# Altium schematic sheet power_management.SchDoc
size A
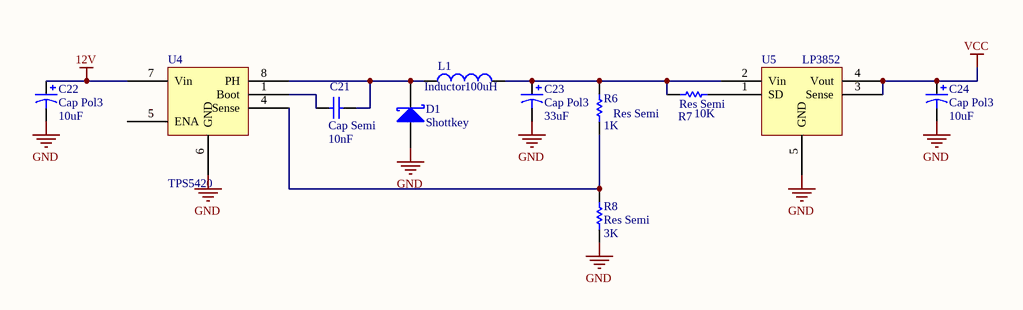
[diagram p0: power_management.SchDoc]

## Parts
C21  Cap Semi  value 10nF  [C0805]
C22  Cap Pol3  value 10uF  [TC6032-2412]
C23  Cap Pol3  value 33uF  [TC6032-2412]
C24  Cap Pol3  value 10uF  [TC3216-1206]
D1  Shottkey  [TO-220AC]
L1  Inductor  value 100uH  [SB_IND]
R6  Res Semi  value 1K  [6-0805_M]
R7  Res Semi  value 10K  [6-0805_M]
R8  Res Semi  value 3K  [6-0805_M]
U4  TPS5420  [SO8_M]
U5  LP3852  [SOT223-5N]

## Nets
12V: C22.1 U4.7(Vin)
GND: C22.2 C23.2 C24.2 D1.3(A) R8.1 U4.6(GND) U5.5(GND)
VCC: C24.1 U5.3(Sense) U5.4(Vout)
NetC21_1: C21.1 U4.1(Boot)
NetC21_2: C21.2 D1.1(K) L1.1 U4.8(PH)
NetC23_1: C23.1 L1.2 R6.2 R7.1 U5.2(Vin)
NetR6_1: R6.1 R8.2 U4.4(Sense)
NetR7_2: R7.2 U5.1(SD)

Not connected (* = marked no-connect by the designer): U4 5(ENA)

## Library data of the parts
C21 = Cap Semi: Capacitor (Semiconductor SIM Model); Published: 8-Jun-2000; LatestRevisionDate: 29-May-2009; LatestRevisionNote: IPC-7351 Footprint Added.; PackageReference: C1206; Publisher: Altium Limited; PackageDescription: Chip Capacitor
C22-C24 = Cap Pol3: Polarized Capacitor (Surface Mount); Published: 8-Jun-2000; LatestRevisionDate: 29-May-2009; LatestRevisionNote: IPC-7351 Footprint Added.; PackageReference: C0805; Publisher: Altium Limited; PackageDescription: Chip Capacitor
  C22: Digikey PN: 718-1052-6-ND
  C23: Digikey PN: 718-1077-1-ND
D1 = Diode 10TQ035: Schottky Rectifier; Note: Terminal 2 is the TAB and is electrically connected to the cathode; Published: 8-Jun-2000; LatestRevisionDate: 17-Jul-2002; LatestRevisionNote: Re-released for DXP Platform.; DatasheetVersion: PD-2.057B; PackageVersion: Feb-1998; PackageReference: TO-220AC; Publisher: Altium Limited; PackageDescription: TO, Thru-Hole, Vertical, Heatsink Mounted; 3 In-Line Leads (1 Absent); Pitch 2.54 mm; ComponentLink1Description: Manufacturer Link; ComponentLink1URL: http://www.irf.com/; ComponentLink2Description: Datasheet; ComponentLink2URL: http://www.irf.com/product-info/datasheets/data/10tq.pdf; Digikey PN: B340A-FDICT-ND
L1 = Inductor: Code_IEC: 1005; Published: 8-Jun-2000; LatestRevisionDate: 29-May-2009; LatestRevisionNote: IPC-7351 Footprint Added.; PackageReference: 0402-A; Publisher: Altium Limited; PackageDescription: Chip Inductor; Code_JEITA: 0402; Digikey PN: 495-1987-1-ND
R6-R8 = Res Semi: Semiconductor Resistor; Published: 8-Jun-2000; LatestRevisionDate: 17-Jul-2002; LatestRevisionNote: Re-released for DXP Platform.; PackageReference: AXIAL-0.5; Publisher: Altium Limited
  R6 R8: PackageDescription: Axial Device, Thru-Hole; 2 Leads; 0.5 in Pin Spacing
U4 = TPS5420: 2A Wide Input Range Step-Down Swift Converter; Datasheet: http://www.ti.com/lit/ds/symlink/tps5420.pdf; Digikey PN: 296-19671-5-ND
U5 = LP3852: 1.5A Fast Response Ultra Low Dropout Linear Regulator; Digikey PN: LP3852EMP-5.0/NOPBCT-ND; Datasheet: http://www.ti.com/lit/ds/symlink/lp3852.pdf